# Altium schematic sheet Insoladora.SchDoc
size A3; Organization: Altium Limited; Address1: L3, 12a Rodborough Rd; Address2: Frenchs Forest; Address3: NSW; Address4: Australia 2086
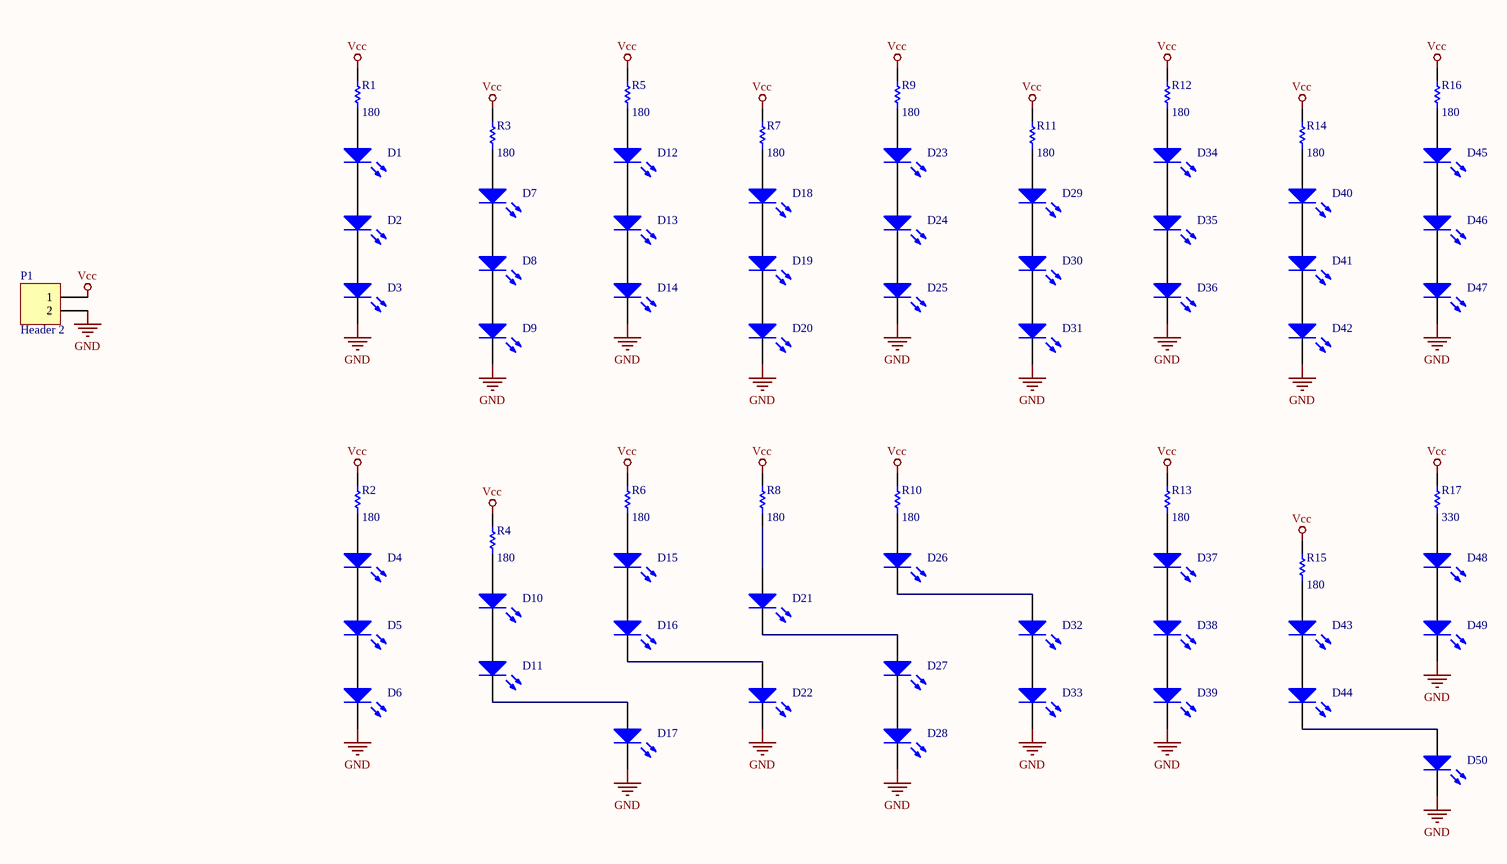
[diagram p0: Insoladora.SchDoc]

## Parts
D1  LEDUV  [LED Clear]  (value not drawn)
D2  LEDUV  [LED Clear]  (value not drawn)
D3  LEDUV  [LED Clear]  (value not drawn)
D4  LEDUV  [LED Clear]  (value not drawn)
D5  LEDUV  [LED Clear]  (value not drawn)
D6  LEDUV  [LED Clear]  (value not drawn)
D7  LEDUV  [LED Clear]  (value not drawn)
D8  LEDUV  [LED Clear]  (value not drawn)
D9  LEDUV  [LED Clear]  (value not drawn)
D10  LEDUV  [LED Clear]  (value not drawn)
D11  LEDUV  [LED Clear]  (value not drawn)
D12  LEDUV  [LED Clear]  (value not drawn)
D13  LEDUV  [LED Clear]  (value not drawn)
D14  LEDUV  [LED Clear]  (value not drawn)
D15  LEDUV  [LED Clear]  (value not drawn)
D16  LEDUV  [LED Clear]  (value not drawn)
D17  LEDUV  [LED Clear]  (value not drawn)
D18  LEDUV  [LED Clear]  (value not drawn)
D19  LEDUV  [LED Clear]  (value not drawn)
D20  LEDUV  [LED Clear]  (value not drawn)
D21  LEDUV  [LED Clear]  (value not drawn)
D22  LEDUV  [LED Clear]  (value not drawn)
D23  LEDUV  [LED Clear]  (value not drawn)
D24  LEDUV  [LED Clear]  (value not drawn)
D25  LEDUV  [LED Clear]  (value not drawn)
D26  LEDUV  [LED Clear]  (value not drawn)
D27  LEDUV  [LED Clear]  (value not drawn)
D28  LEDUV  [LED Clear]  (value not drawn)
D29  LEDUV  [LED Clear]  (value not drawn)
D30  LEDUV  [LED Clear]  (value not drawn)
D31  LEDUV  [LED Clear]  (value not drawn)
D32  LEDUV  [LED Clear]  (value not drawn)
D33  LEDUV  [LED Clear]  (value not drawn)
D34  LEDUV  [LED Clear]  (value not drawn)
D35  LEDUV  [LED Clear]  (value not drawn)
D36  LEDUV  [LED Clear]  (value not drawn)
D37  LEDUV  [LED Clear]  (value not drawn)
D38  LEDUV  [LED Clear]  (value not drawn)
D39  LEDUV  [LED Clear]  (value not drawn)
D40  LEDUV  [LED Clear]  (value not drawn)
D41  LEDUV  [LED Clear]  (value not drawn)
D42  LEDUV  [LED Clear]  (value not drawn)
D43  LEDUV  [LED Clear]  (value not drawn)
D44  LEDUV  [LED Clear]  (value not drawn)
D45  LEDUV  [LED Clear]  (value not drawn)
D46  LEDUV  [LED Clear]  (value not drawn)
D47  LEDUV  [LED Clear]  (value not drawn)
D48  LEDUV  [LED Clear]  (value not drawn)
D49  LEDUV  [LED Clear]  (value not drawn)
D50  LEDUV  [LED Clear]  (value not drawn)
P1  Header 2  [HEADER 2]
R1  value 180  (hidden comment: Res1)
R2  value 180  (hidden comment: Res1)
R3  value 180  (hidden comment: Res1)
R4  value 180  (hidden comment: Res1)
R5  value 180  (hidden comment: Res1)
R6  value 180  (hidden comment: Res1)
R7  value 180  (hidden comment: Res1)
R8  value 180  (hidden comment: Res1)
R9  value 180  (hidden comment: Res1)
R10  value 180  (hidden comment: Res1)
R11  value 180  (hidden comment: Res1)
R12  value 180  (hidden comment: Res1)
R13  value 180  (hidden comment: Res1)
R14  value 180  (hidden comment: Res1)
R15  value 180  (hidden comment: Res1)
R16  value 180  (hidden comment: Res1)
R17  value 330  (hidden comment: Res1)

## Nets
GND: D3.2(K) D6.2(K) D9.2(K) D14.2(K) D17.2(K) D20.2(K) D22.2(K) D25.2(K) D28.2(K) D31.2(K) D33.2(K) D36.2(K) D39.2(K) D42.2(K) D47.2(K) D49.2(K) D50.2(K) P1.2
Vcc: P1.1 R1.2 R2.2 R3.2 R4.2 R5.2 R6.2 R7.2 R8.2 R9.2 R10.2 R11.2 R12.2 R13.2 R14.2 R15.2 R16.2 R17.2
NetD1_1: D1.1(A) R1.1
NetD1_2: D1.2(K) D2.1(A)
NetD2_2: D2.2(K) D3.1(A)
NetD4_1: D4.1(A) R2.1
NetD4_2: D4.2(K) D5.1(A)
NetD5_2: D5.2(K) D6.1(A)
NetD7_1: D7.1(A) R3.1
NetD7_2: D7.2(K) D8.1(A)
NetD8_2: D8.2(K) D9.1(A)
NetD10_1: D10.1(A) R4.1
NetD10_2: D10.2(K) D11.1(A)
NetD11_2: D11.2(K) D17.1(A)
NetD12_1: D12.1(A) R5.1
NetD12_2: D12.2(K) D13.1(A)
NetD13_2: D13.2(K) D14.1(A)
NetD15_1: D15.1(A) R6.1
NetD15_2: D15.2(K) D16.1(A)
NetD16_2: D16.2(K) D22.1(A)
NetD18_1: D18.1(A) R7.1
NetD18_2: D18.2(K) D19.1(A)
NetD19_2: D19.2(K) D20.1(A)
NetD21_1: D21.1(A) R8.1
NetD21_2: D21.2(K) D27.1(A)
NetD23_1: D23.1(A) R9.1
NetD23_2: D23.2(K) D24.1(A)
NetD24_2: D24.2(K) D25.1(A)
NetD26_1: D26.1(A) R10.1
NetD26_2: D26.2(K) D32.1(A)
NetD27_2: D27.2(K) D28.1(A)
NetD29_1: D29.1(A) R11.1
NetD29_2: D29.2(K) D30.1(A)
NetD30_2: D30.2(K) D31.1(A)
NetD32_2: D32.2(K) D33.1(A)
NetD34_1: D34.1(A) R12.1
NetD34_2: D34.2(K) D35.1(A)
NetD35_2: D35.2(K) D36.1(A)
NetD37_1: D37.1(A) R13.1
NetD37_2: D37.2(K) D38.1(A)
NetD38_2: D38.2(K) D39.1(A)
NetD40_1: D40.1(A) R14.1
NetD40_2: D40.2(K) D41.1(A)
NetD41_2: D41.2(K) D42.1(A)
NetD43_1: D43.1(A) R15.1
NetD43_2: D43.2(K) D44.1(A)
NetD44_2: D44.2(K) D50.1(A)
NetD45_1: D45.1(A) R16.1
NetD45_2: D45.2(K) D46.1(A)
NetD46_2: D46.2(K) D47.1(A)
NetD48_1: D48.1(A) R17.1
NetD48_2: D48.2(K) D49.1(A)

## Notes on the sheet
- Title
- Size:
- Date:
- A3
- Number:
- Time:
- Revision:
- Sheet
- of
- File:

## Library data of the parts
D1-D50 = LED2: LED UV 5mm 25° apertura; Published: 8-Jun-2000; LatestRevisionDate: 17-Jul-2002; LatestRevisionNote: Re-released for DXP Platform.; PackageVersion: Feb-2002; PackageReference: 3.2X1.6X1.1; Publisher: Altium Limited; PackageDescription: SM LED; 2 Flat Leads
P1 = Header 2: Header, 2-Pin; LatestRevisionDate: 17-Jul-2002; LatestRevisionNote: Re-released for DXP Platform.; Publisher: Altium Limited
R1-R17 = Res1: Resistor; Published: 8-Jun-2000; LatestRevisionDate: 17-Jul-2002; LatestRevisionNote: Re-released for DXP Platform.; PackageReference: AXIAL-0.3; Publisher: Altium Limited; PackageDescription: Axial Device, Thru-Hole; 2 Leads; 0.3 in Pin Spacing